# EAGLE design PICKIT4-adaptor3 (EAGLE 7.7.0)
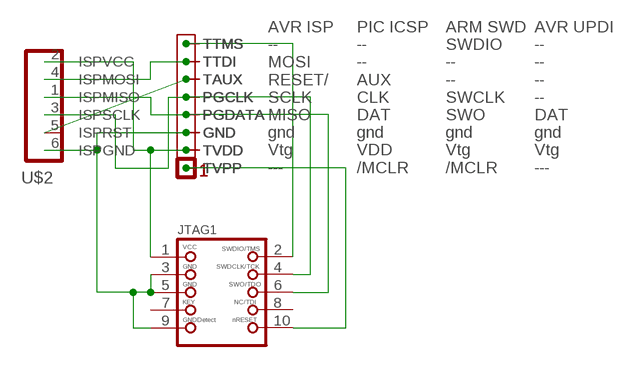
[diagram p0: schematic, sheet 1]

## Parts
JTAG1  JTAG-CORTEXM3  [2X05_1.27MM_SMT]
U$1  PICKIT4PINHDR  [PINHEAD1X8]
U$2  AVR-ISP  [6PINS]
U$3  PICKIT4PINHDR  [PINHEAD1X8]
U$4  PICKIT4PINHDR  [PINHEAD1X8]

## Nets
CLK: JTAG1.4 U$1.P$5(PGCLK) U$2.3(ISPSCLK) U$3.P$5(PGCLK) U$4.P$5(PGCLK)
DATA: JTAG1.6 U$1.P$4(PGDATA) U$2.1(ISPMISO) U$3.P$4(PGDATA) U$4.P$4(PGDATA)
GND: JTAG1.3 JTAG1.5 JTAG1.9 U$1.P$3(GND) U$2.6(ISPGND) U$3.P$3(GND) U$4.P$3(GND)
TAUX: U$1.P$6(TAUX) U$2.5(ISPRST) U$3.P$6(TAUX) U$4.P$6(TAUX)
TTDI: U$1.P$7(TTDI) U$2.4(ISPMOSI) U$3.P$7(TTDI) U$4.P$7(TTDI)
TTMS: JTAG1.2 U$1.P$8(TTMS) U$3.P$8(TTMS) U$4.P$8(TTMS)
TVDD: JTAG1.1 U$1.P$2(TVDD) U$2.2(ISPVCC) U$3.P$2(TVDD) U$4.P$2(TVDD)
VPP: JTAG1.10 U$1.P$1(TVPP) U$3.P$1(TVPP) U$4.P$1(TVPP)
Unconnected: JTAG1.7 JTAG1.8

## Library data of the parts
JTAG1 = microbuilder:JTAG-CORTEXM3: Serial Wire (SW-DP) Connector This standard 0.05" 10-pin connector is for use with the Cortex M0/M3's native SWD (serial wire debugger) interface (SW-DP). Some boards support a 20-pin combined JTAG+SWD connector (SWJ-DP), such as the LPC1700 family, but many smaller devices only work with SWD which typically use the smaller 10-pin SW-DP connecter (the LPC1300 family, for example, only supports SWD). 2x05 1.27mm/0.05" Connector: This is the standard SMT connector defined by ARM for all Cortex devices, and should be used in most situations and for forward-compatibility since any new devices coming to market will likely use this connector. MOLEX 10 Pin 0.1" Connector: This 0.1" 10 pin connector has the same pin layout as the standard 0.05" connector, but is easier to work with if you are using standard jumper wires or custom cables to connect your SWD hardware. MOLEX 20 Pin 0.1" Connector: This 0.1" 20 pin connector is the same model used for ARM7/ARM9 JTAG debuggers, but is connected to match the pins on the Segger J-Link for ARM (which supports both JTAG and SWD debugging). See the following document from ARM for more information on Cortex M3 Debug Connectors: http://infocenter.arm.com/help/topic/com.arm.doc.faqs/attached/13634/cortex_debug_connectors.pdf And the following page for an overview with images of the different connector types: http://www.keil.com/peripherals/coresight/connectors.asp
U$1 U$3 U$4 = mylib4:PICKIT4: PICKIT 4 Programming connector Handles PICx, ARM SWD, AVR ISP, UPDI, PDI, TPI, an JTAG/EJTAG
U$2 = Arduino-shield-scaffolds:AVR-ISP: AVR SPI ISP programming connector (6pins)

## Net classes
0 default: width 0.4 mm, drill 0.6 mm, clearance 0.3 mm
1 power: width 0.8 mm, drill 0.7 mm, clearance 0.4 mm
2 clock: width 0.25 mm, drill 0.6 mm, clearance 0.3 mm

## Board
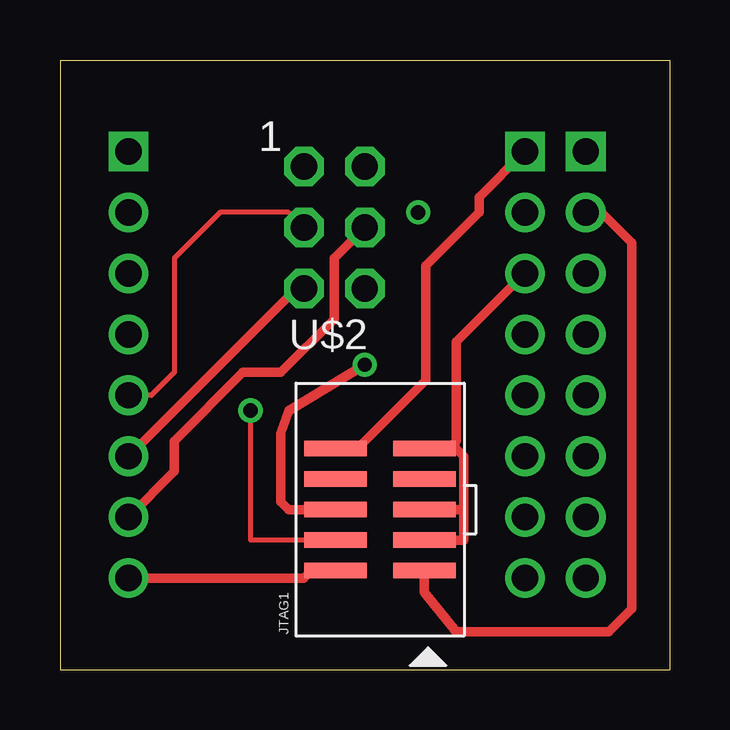
[diagram p1: board, top side]
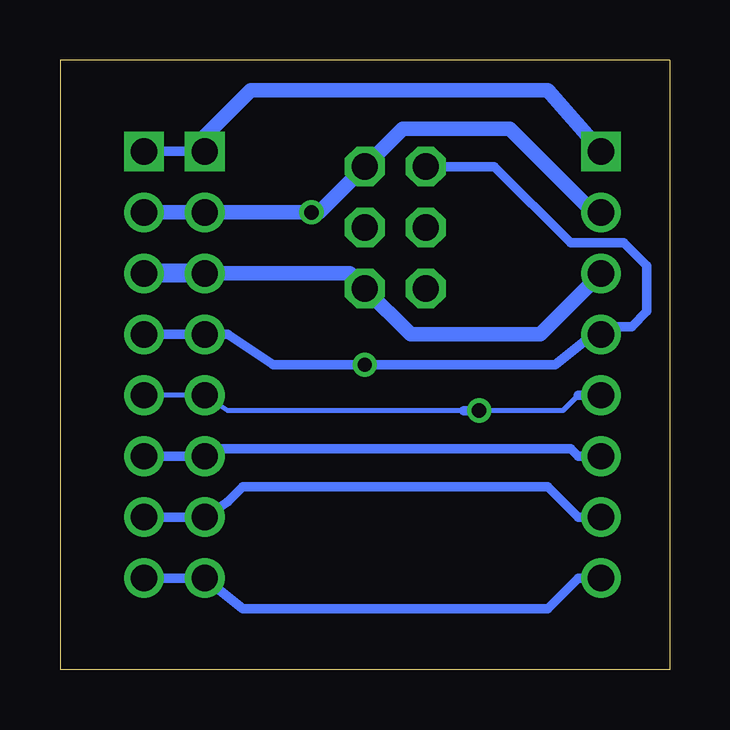
[diagram p2: board, bottom side, seen from below]

Size 25.4 x 25.4 mm. Coordinates in mm from the lower left corner, seen from the top.
Outline: 0,0 25.4,0 25.4,25.4 0,25.4 0,0
Copper layers (1*16): Top 0.035mm / dielectric 1.5mm / Bottom 0.035mm
Design rules "default": minimum track width 10mil, minimum drill 24mil, track to track 8mil, track to pad 8mil, pad to pad 8mil, via to via 8mil, smd to smd 8mil, copper to edge 40mil, drill to drill 8mil, minimum pad ring 10mil, minimum via ring 8mil, stop-mask expansion 4mil, vias tented up to drill 0mil, thermal gap 10mil

### Footprints (pad centres in the part's own frame; a part is rotated, then mirrored left to right if it is on the bottom)
2X05_1.27MM_SMT = smd 0.65 x 2.6: 1 -2.54,-1.85; 2 -2.54,1.85; 3 -1.27,-1.85; 4 -1.27,1.85; 5 0,-1.85; 6 0,1.85; 7 1.27,-1.85; 8 1.27,1.85; 9 2.54,-1.85; 10 2.54,1.85
PINHEAD1X8 = drill 1.1 square: P$1 0,8.89 | drill 1.1: P$2 0,6.35; P$3 0,3.81; P$4 0,1.27; P$5 0,-1.27; P$6 0,-3.81; P$7 0,-6.35; P$8 0,-8.89
6PINS = drill 1.1 octagon: 1 -1.27,2.54; 2 1.27,2.54; 3 -1.27,0; 4 1.27,0; 5 -1.27,-2.54; 6 1.27,-2.54

### Placement (x,y rotation side)
JTAG1  13.34,6.67 90 top
U$1  2.86,12.7 0 top
U$2  11.43,18.41 0 top
U$3  21.91,12.7 0 top
U$4  19.37,12.7 0 top

### Tracks (layer width: path | path; a pad name or v marks a point on that pad's centre or on a via)
CLK  (via drill 0.6)
  Top 0.2: U$2.3 9.53,19.05 6.67,19.05 4.76,17.14 4.76,12.38 3.81,11.43 U$1.P$5 | JTAG1.4 7.94,5.4 v7.94,10.79
  Top 0.4: 3.17,11.43 U$1.P$5
  Bottom 0.2: 3.81,11.43 4.45,10.79 v7.94,10.79 | 8.57,10.79 18.41,10.79 U$4.P$5 U$3.P$5
  Bottom 0.4: U$1.P$5 3.81,11.43 | v7.94,10.79 8.57,10.79
DATA  (via drill 0.6)
  Top 0.4: JTAG1.6 9.53,6.67 9.21,6.99 9.21,9.84 9.53,10.79 v12.7,12.7
  Bottom 0.4: U$3.P$4 U$4.P$4 18.41,13.97 16.51,12.7 v12.7,12.7 4.76,12.7 3.17,13.97 U$1.P$4 2.54,14.29 1.59,14.29 0.95,14.92 0.95,16.83 1.91,17.78 4.13,17.78 7.3,20.95 U$2.1
GND
  Top 0.4: JTAG1.3 16.83,5.4 16.83,6.67 | 16.83,6.67 16.83,8.89 16.51,9.21 JTAG1.9 16.19,9.21 16.51,9.53 16.51,13.65 U$4.P$3 | JTAG1.5 16.83,6.67
  Bottom 0.6: U$1.P$3 5.4,13.97 10.79,13.97 U$2.6 13.34,16.51 U$4.P$3
  Bottom 0.8: U$4.P$3 U$3.P$3
TAUX
  Top 0.4: U$2.5 9.84,15.88 U$1.P$6
  Bottom 0.4: U$1.P$6 3.81,8.89 4.13,9.21 18.73,9.21 19.05,8.89 U$4.P$6 U$3.P$6
TTDI
  Top 0.4: U$1.P$7 4.76,8.26 4.76,9.53 7.62,12.38 9.21,12.38 11.43,14.61 11.43,17.14 U$2.4
  Bottom 0.4: U$1.P$7 3.81,6.35 5.08,7.62 17.78,7.62 18.41,6.99 U$4.P$7 U$3.P$7
TTMS
  Top 0.4: JTAG1.2 10.48,4.13 10.16,3.81 U$1.P$8
  Bottom 0.4: U$1.P$8 3.81,3.81 5.08,2.54 17.78,2.54 U$4.P$8 U$3.P$8
TVDD  (via drill 0.6)
  Top 0.4: JTAG1.1 15.19,3.23 16.51,1.59 22.86,1.59 23.81,2.54 23.81,17.78 22.54,19.05 U$3.P$2
  Bottom 0.6: U$3.P$2 U$4.P$2 v14.92,19.05 14.61,19.05 U$2.2 11.11,22.54 6.67,22.54 3.17,19.05 U$1.P$2
VPP
  Top 0.4: JTAG1.10 12.38,9.21 15.24,12.06 15.24,16.83 17.46,19.05 17.46,19.68 U$4.P$1
  Bottom 0.4: U$4.P$1 U$3.P$1
  Bottom 0.6: U$1.P$1 5.08,24.13 17.46,24.13 19.37,22.23 U$4.P$1